# EAGLE design Stator_PCB_ver_1.1 (EAGLE 7.4.0)
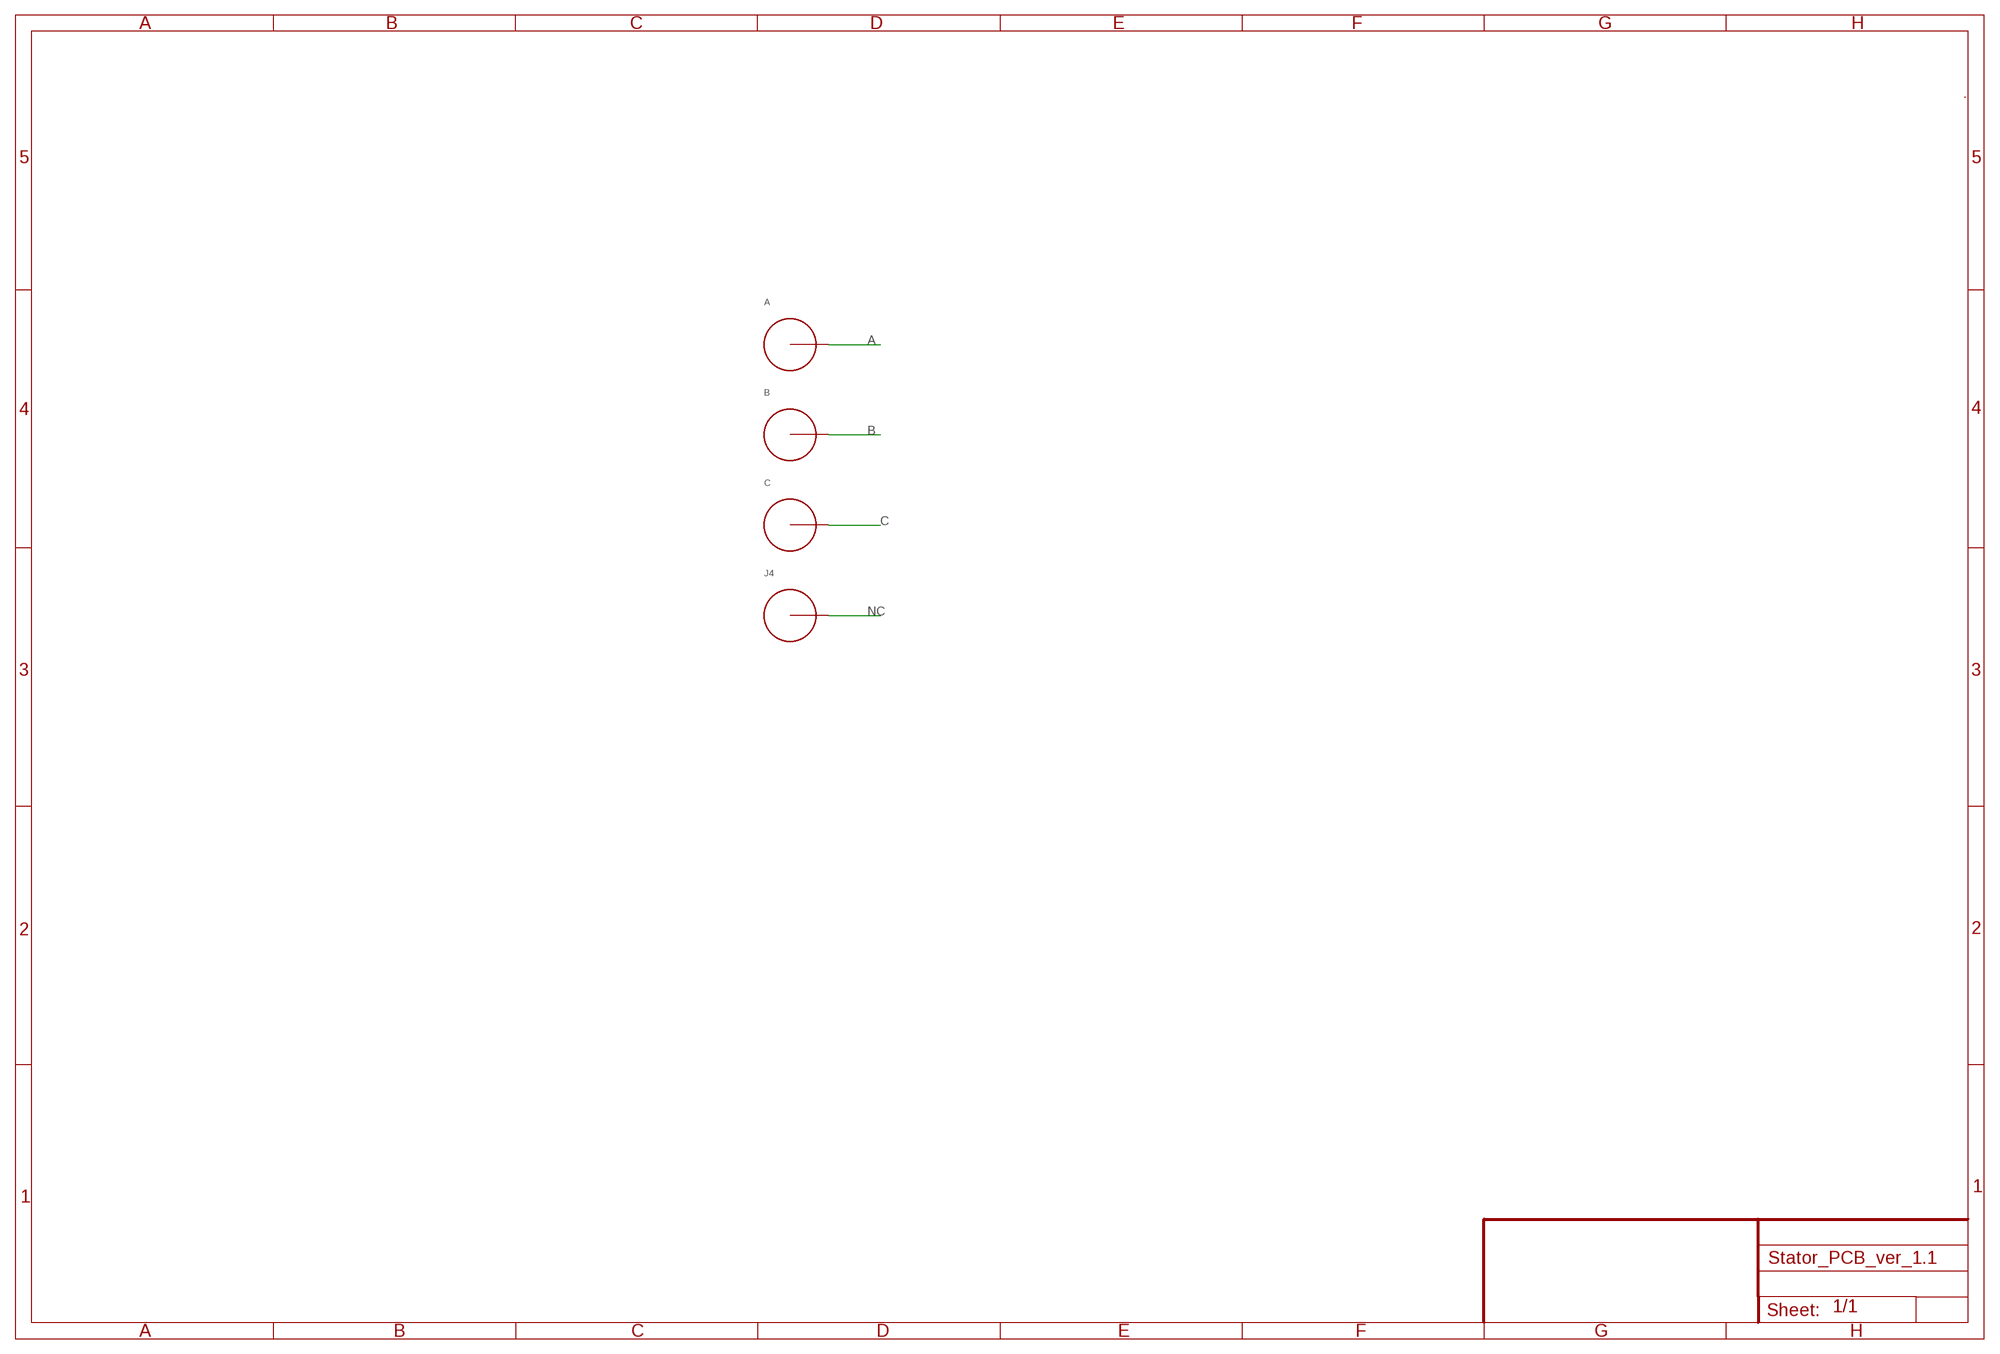
[diagram p0: schematic, sheet 1]

## Parts
A  48834883  [4883]
B  48834883  [4883]
C  48834883  [4883]
J4  48834883  [4883]

## Nets
A: A.P$1
B: B.P$1
C: C.P$1
NC: J4.P$1

## Library data of the parts
A B C J4 = KEYSTONE:4883

## Board
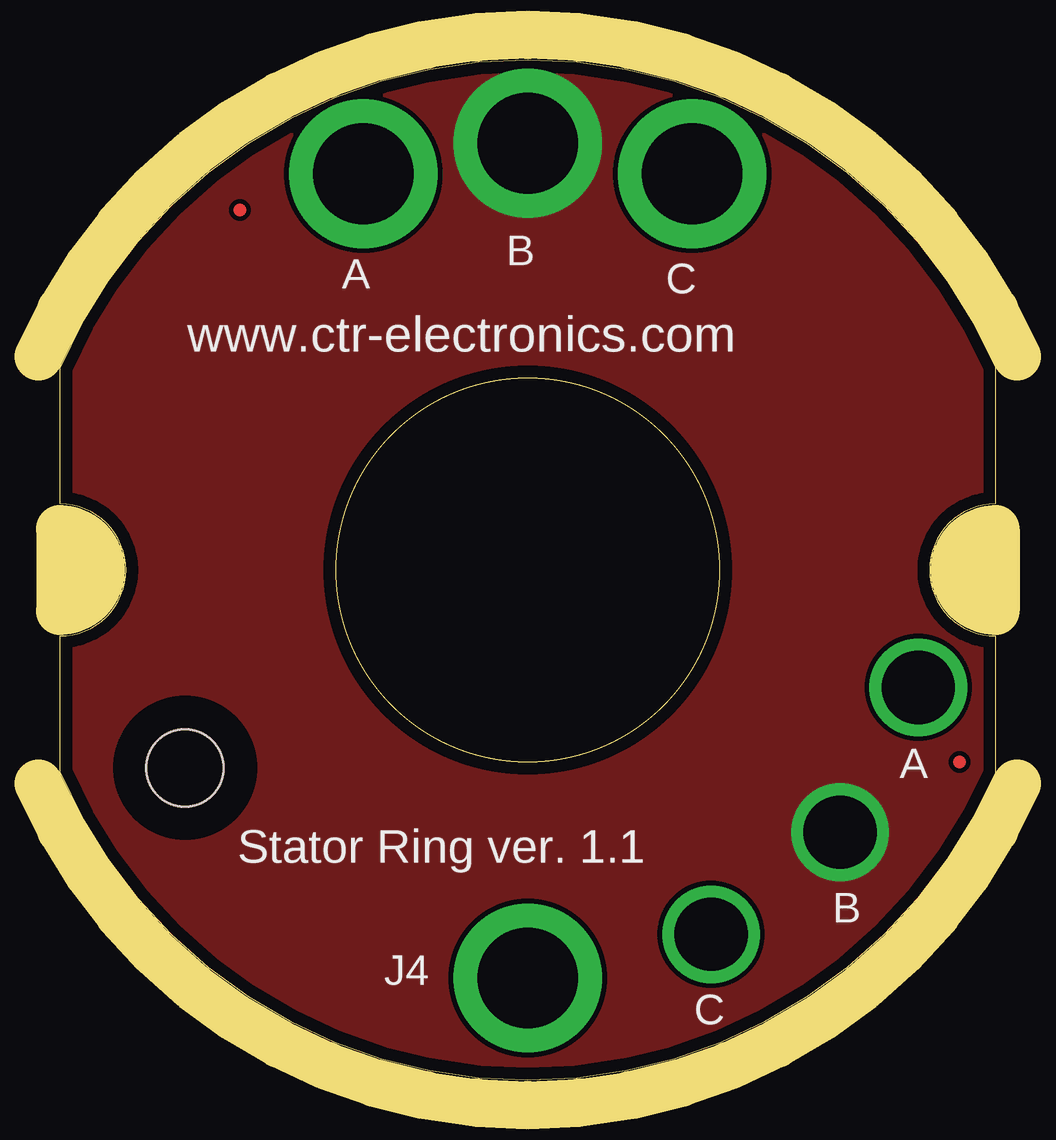
[diagram p1: board, top side]
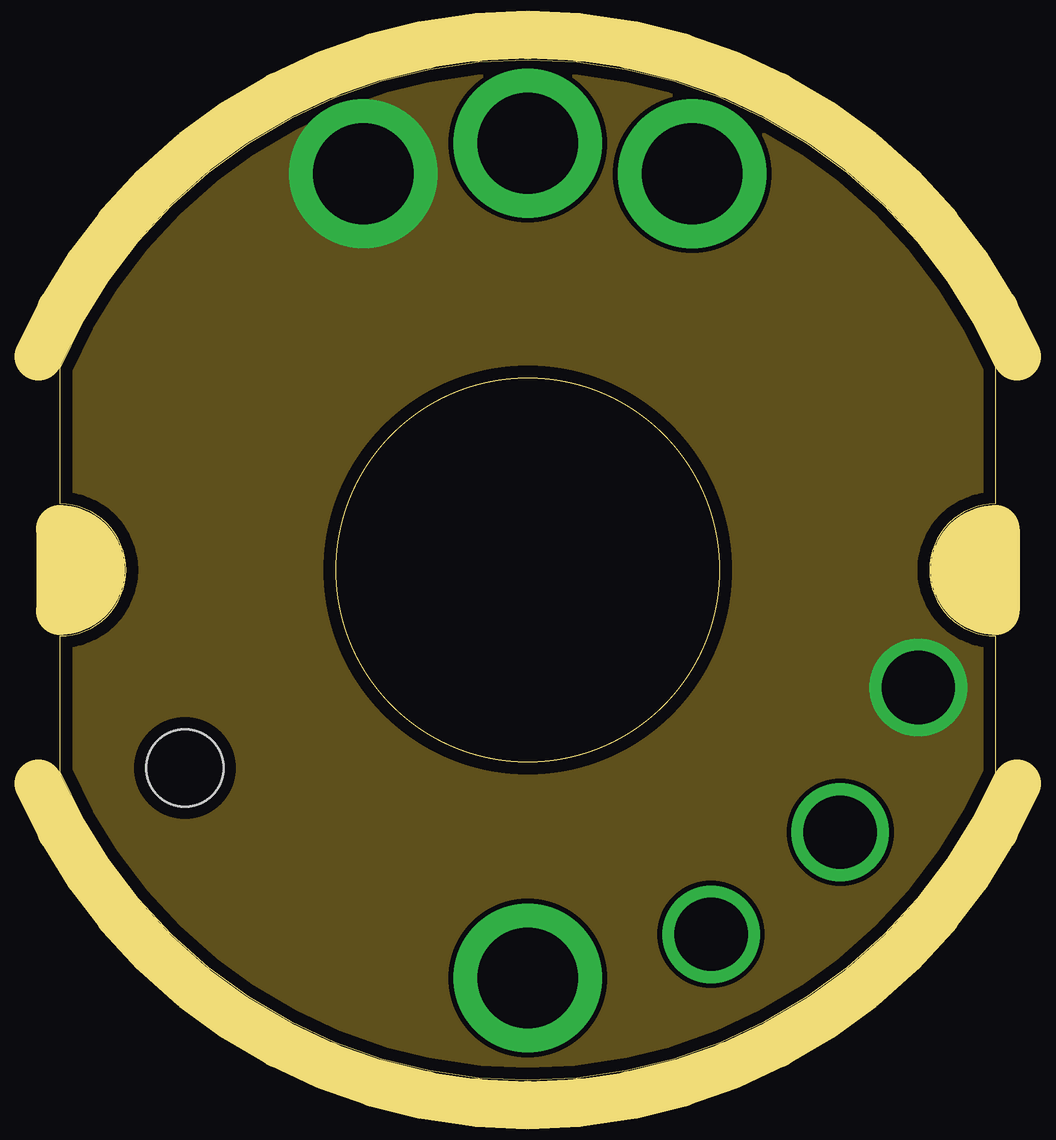
[diagram p2: board, inner layer Route2]
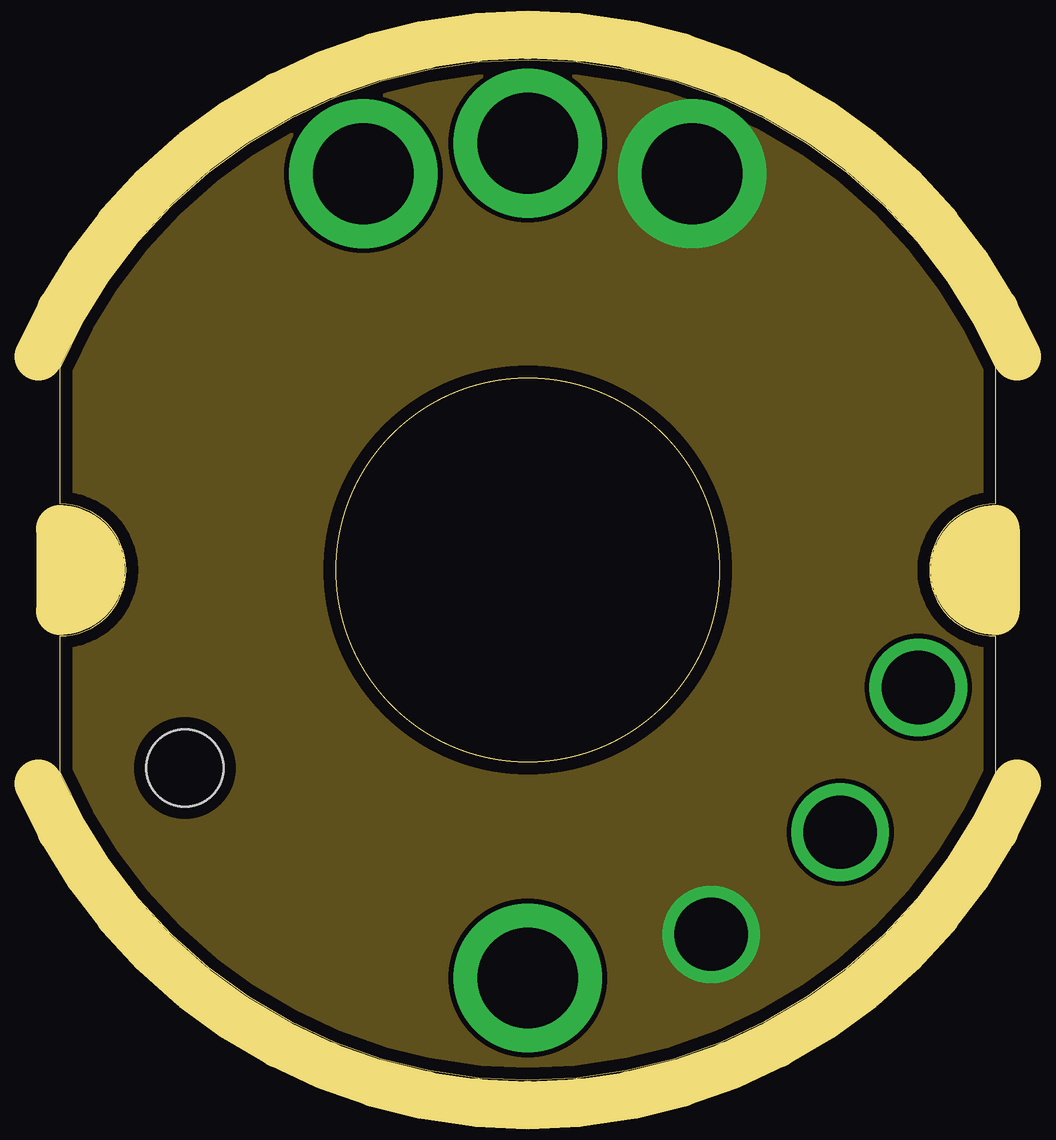
[diagram p3: board, inner layer Route3]
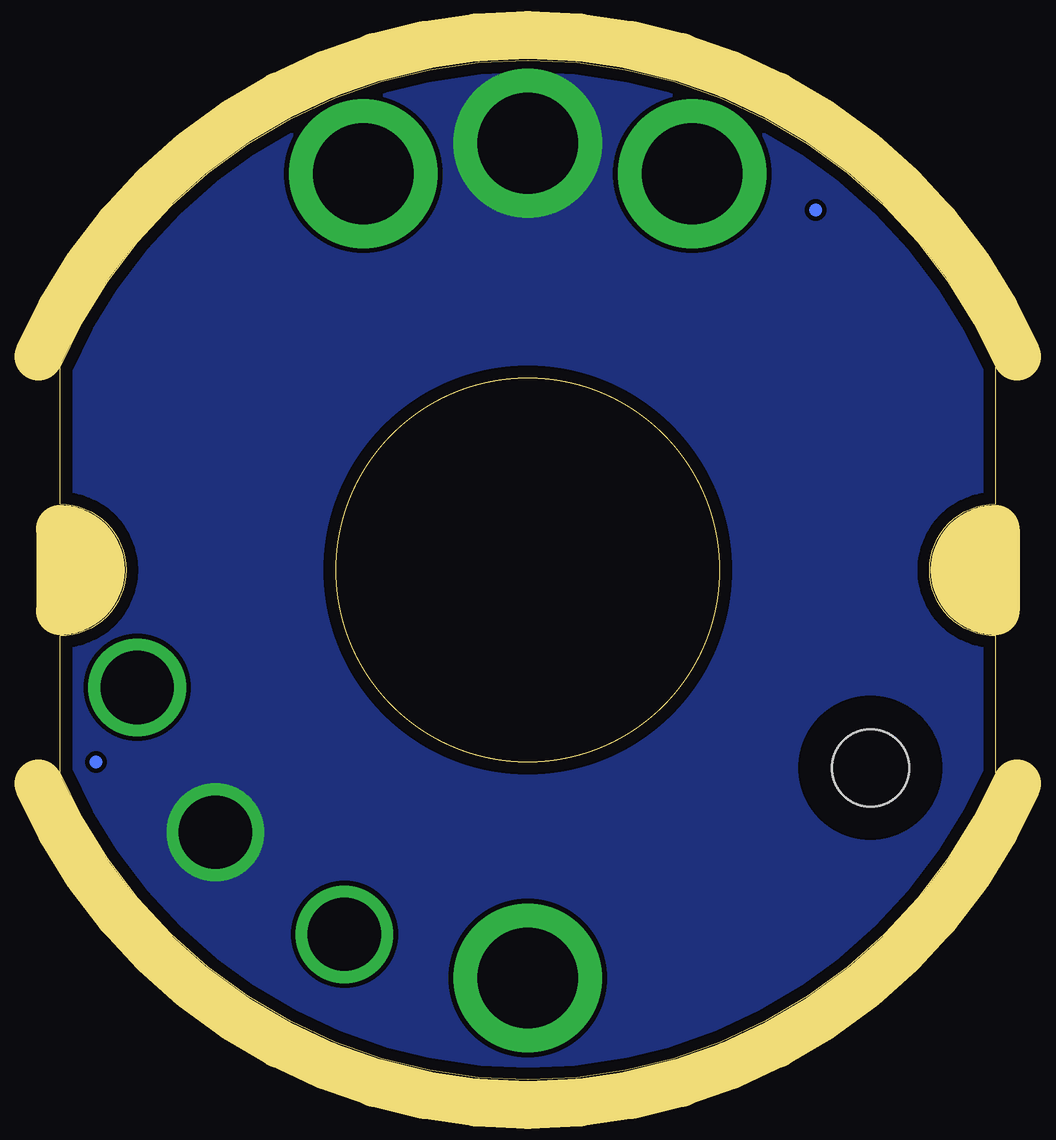
[diagram p4: board, bottom side, seen from below]

Size 39 x 42.5 mm. Coordinates in mm from the lower left corner, seen from the top.
Outline: 39,12.8 39,18.5 arc-180 39,24 39,29.69 arc133 0,29.69 0,24 arc-180 0,18.5 0,12.8 arc133 39,12.8
Outline: circle at 19.5,21.25 radius 8
Copper layers (1+2*3+16): Top 0.07mm / dielectric 6mil / Route2 0.07111875mm / dielectric 0.99821875mm / Route3 0.035mm / dielectric 6mil / Bottom 0.035mm
Design rules "default *": minimum track width 7mil, minimum drill 8mil, track to track 0.1968mm, track to pad 0.1968mm, pad to pad 0.1968mm, via to via 0.1968mm, smd to smd 0.1968mm, copper to edge 20mil, drill to drill 8mil, minimum pad ring 5mil, minimum via ring 5mil, stop-mask expansion 2mil, vias tented up to drill 20mil, thermal gap 10mil
Holes 3.2 mm at 5.21,13
tRestrict: area 2.2,10 to 8.2,16
bRestrict: area 2.2,10 to 8.2,16
Milling: 24 lines

### Footprints (pad centres in the part's own frame; a part is rotated, then mirrored left to right if it is on the bottom)
4883 = drill 4.2 pad 6.2: P$1 0,0

### Placement (x,y rotation side)
A  12.64,37.76 0 top
B  19.5,39.03 0 top
C  26.36,37.76 0 top
J4  19.5,4.25 0 top
U$1  [20_MIL_FID]  37.5,13.25 0 top
U$2  [20_MIL_FID]  7.5,36.25 0 top

### Tracks (layer width: path | path; a pad name or v marks a point on that pad's centre or on a via)
A  (via drill 3.05 pad 4)
  other vias: 35.78,16.36
  pour Route2 (no thermals): -0.23,42.5 39.5,42.5 39.5,-0.24 -0.23,-0.24
B  (via drill 3.05 pad 4)
  other vias: 32.52,10.32
  pour Bottom (no thermals): -0.23,42.5 39.5,42.5 39.5,-0.24 -0.23,-0.24
  pour Top (no thermals): -0.23,42.5 39.5,42.5 39.5,-0.24 -0.23,-0.24
C  (via drill 3.05 pad 4)
  other vias: 27.15,6.07
  pour Route3 (no thermals): -0.23,42.5 39.5,42.5 39.5,-0.24 -0.23,-0.24

### Text on the board
tPlace: www.ctr-electronics.com | Stator Ring ver. 1.1
tNames: A | B | C
Panel: Dimensions in inches unless otherwise noted. | PCB manufacturer tooling holes | 4 places | V-score | Router